# Altium schematic sheet FLASH.SchDoc
size A
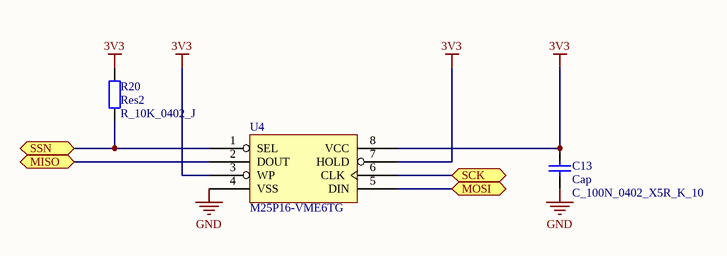
[diagram p0: FLASH.SchDoc]

## Parts
C13  Cap  value C_100N_0402_X5R_K_10  [C_0402]
R20  Res2  value R_10K_0402_J  [R_0402]
U4  M25P16-VME6TG  [VQFNPN8]

## Ports
MISO, MOSI, SCK, SSN

## Nets
3V3: C13.2 R20.2 U4.3(WP) U4.7(HOLD) U4.8(VCC)
GND: C13.1 U4.4(VSS)
MISO: U4.2(DOUT) ; port MISO
MOSI: U4.5(DIN) ; port MOSI
SCK: U4.6(CLK) ; port SCK
SSN: R20.1 U4.1(SEL) ; port SSN

## Library data of the parts
C13 = Cap: Capacitor; Published: 8-Jun-2000; LatestRevisionDate: 17-Jul-2002; LatestRevisionNote: Re-released for DXP Platform.; Publisher: Altium Limited; Supplier 1: Digi-Key; Supplier Part Number 1: 490-1318-6-ND; Supplier 2: Mouser; Supplier Part Number 2: 81-GRM155R61A104KA01
R20 = Res2: Resistor; Published: 8-Jun-2000; LatestRevisionDate: 17-Jul-2002; LatestRevisionNote: Re-released for DXP Platform.; PackageReference: AXIAL-0.4; Publisher: Altium Limited; PackageDescription: Axial Device, Thru-Hole; 2 Leads; 0.4 in Pin Spacing; Supplier 1: Digi-Key; Supplier Part Number 1: 311-10KJRCT-ND
U4 = M25P16-VME6TG: IC FLASH 16MBIT 75MHZ 8VDFPN; Manufacturer: Micron Technology Inc; Memory Type: FLASH - Nor; Memory Size: 16M (2M x 8); Interface: SPI Serial; Voltage - Supply: 2.7 V ~ 3.6 V; Supplier 1: Digi-Key; Manufacturer Part Number: M25P16-VME6TG; RoHS: RoHS Compliant; Category: Integrated Circuits (ICs); Stock 1: 3584; Pricing 1: 1=1.17, 10=1.062, 25=1.0488, 50=1.0428, 100=0.9322, 250=0.92436, 500=0.91066, 1000=0.87785 (USD); Format - Memory: FLASH; Speed: 75MHz; Operating Temperature: -40°C ~ 85°C; Package / Case: 8-VDFN Exposed Pad; Supplier Device Package: 8-VDFPN (MLP8) (8x6); Packaging: Cut Tape (CT); ComponentLink1URL: http://media.digikey.com/pdf/Data%20Sheets/Numonyx,Intel/M25P16.pdf; ComponentLink1Description: http://media.digikey.com/pdf/Data%20Sheets/Numonyx,Intel/M25P16.pdf; Supplier Part Number 1: M25P16-VME6TGCT-ND